# Altium project Phaser_DIOT.PrjPCB (part 8 of 10)

## Sheet LVDS_IFC.SchDoc: =P_Title
size 420 x 297 mm; EDA_Number: ARTIQ; Projet: ARTIQ/SINARA; Author: G.Kasprowicz; CompanyName: WUT ISE; DrawnBy: G.Kasprowicz; Organization: WUT ISE; Address1: PW ISE; Address2: Nowowiejska 15/19 00-665 Warsaw; Address3: gkasprow@gmail.com; DocumentNumber: 15; Revision: 2; SheetNumber: 15; SheetTotal: 19; ModifiedBy: -; CheckedDate: -; Title2: EEM connectors; DivGrp: WUT ISE; Designer: G.Kasprowicz; ModifiedDate: -; ProjectName: Sensor Box
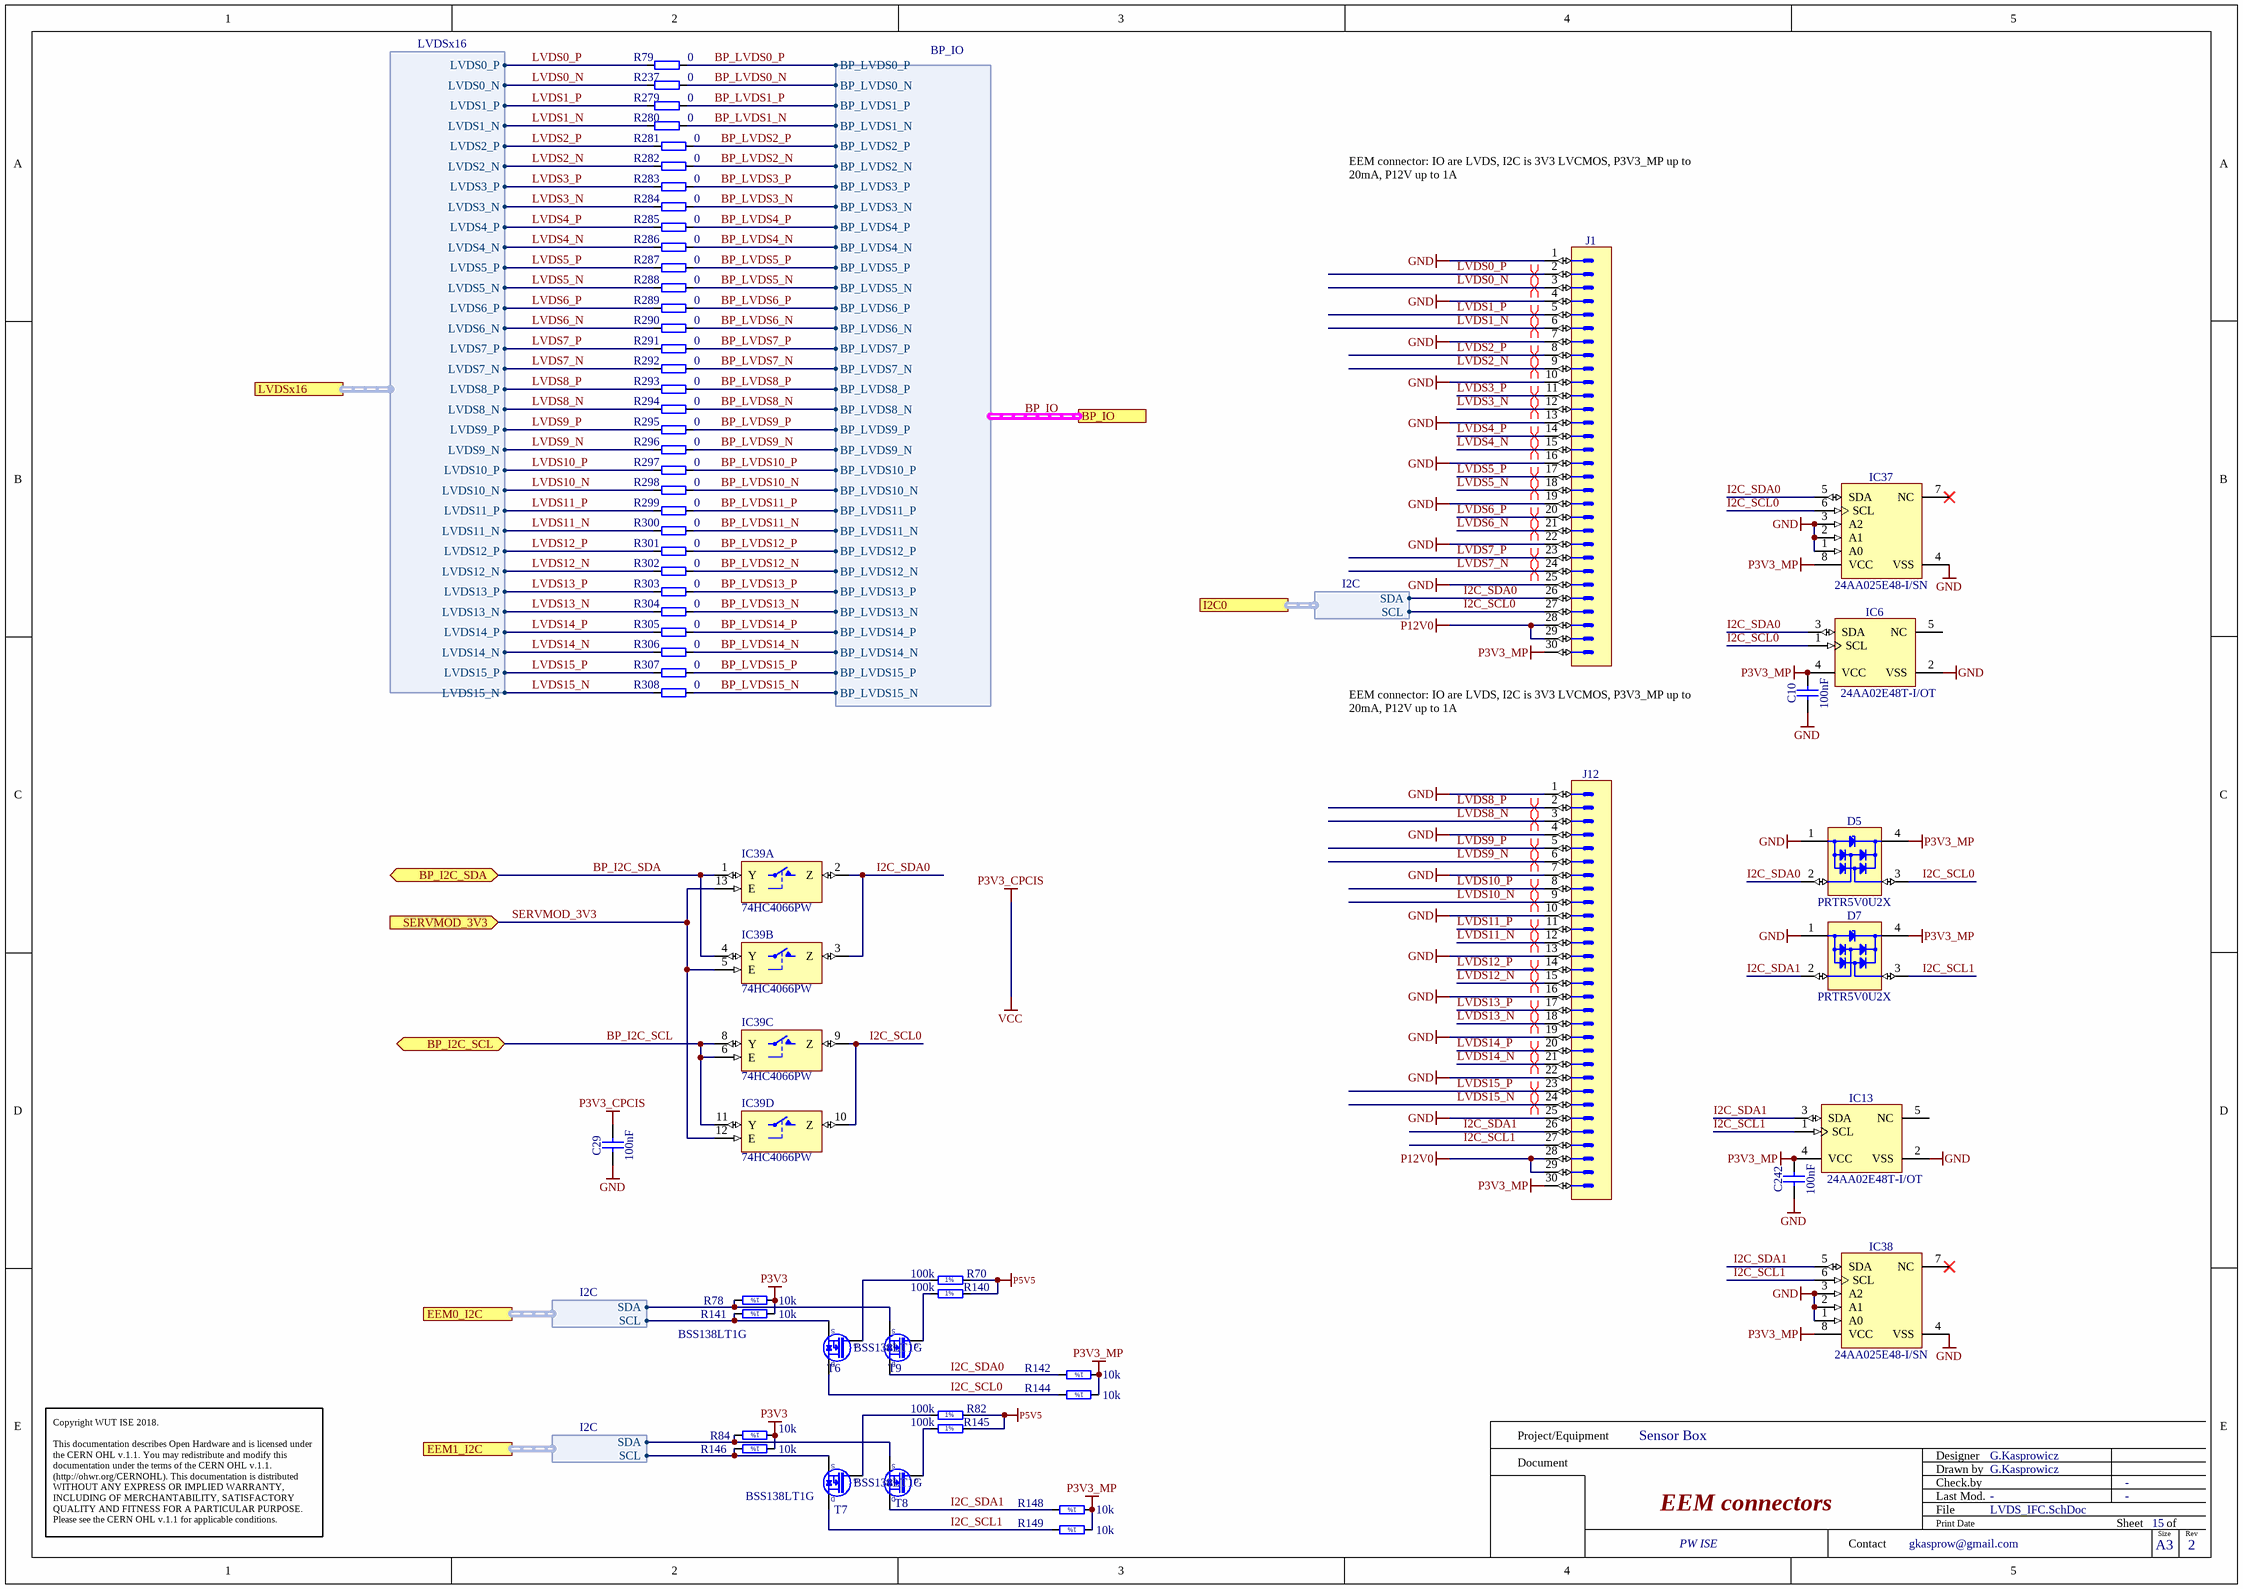
[diagram p16: LVDS_IFC.SchDoc]

### Parts
C10  100nF  [CAPC1005X55N]
C29  100nF  [CAPC1005X55N]
C242  100nF  [CAPC1005X55N]
D5  PRTR5V0U2X  [SOT190P230X110-4N]
D7  PRTR5V0U2X  [SOT190P230X110-4N]
IC6  24AA02E48T-I/OT  [SOT95P280X145-5N]
IC13  24AA02E48T-I/OT  [SOT95P280X145-5N]
IC37  24AA025E48-I/SN  [SOIC127P600X175-8N]
IC38  24AA025E48-I/SN  [SOIC127P600X175-8N]
IC39  74HC4066PW  [SOP65P640X110-14N]  (parts A,B,C,D of 4)
J1  (no value)  [3M_N2530-6002RB]
J12  (no value)  [3M_N2530-6002RB]
R70  100k  [RESC1005X40N]
R78  10k  [RESC1005X40N]
R79  0  [RESC1005X35N]
R82  100k  [RESC1005X40N]
R84  10k  [RESC1005X40N]
R140  100k  [RESC1005X40N]
R141  10k  [RESC1005X40N]
R142  10k  [RESC1005X40N]
R144  10k  [RESC1005X40N]
R145  100k  [RESC1005X40N]
R146  10k  [RESC1005X40N]
R148  10k  [RESC1005X40N]
R149  10k  [RESC1005X40N]
R237  0  [RESC1005X35N]
R279  0  [RESC1005X35N]
R280  0  [RESC1005X35N]
R281  0  [RESC1005X35N]
R282  0  [RESC1005X35N]
R283  0  [RESC1005X35N]
R284  0  [RESC1005X35N]
R285  0  [RESC1005X35N]
R286  0  [RESC1005X35N]
R287  0  [RESC1005X35N]
R288  0  [RESC1005X35N]
R289  0  [RESC1005X35N]
R290  0  [RESC1005X35N]
R291  0  [RESC1005X35N]
R292  0  [RESC1005X35N]
R293  0  [RESC1005X35N]
R294  0  [RESC1005X35N]
R295  0  [RESC1005X35N]
R296  0  [RESC1005X35N]
R297  0  [RESC1005X35N]
R298  0  [RESC1005X35N]
R299  0  [RESC1005X35N]
R300  0  [RESC1005X35N]
R301  0  [RESC1005X35N]
R302  0  [RESC1005X35N]
R303  0  [RESC1005X35N]
R304  0  [RESC1005X35N]
R305  0  [RESC1005X35N]
R306  0  [RESC1005X35N]
R307  0  [RESC1005X35N]
R308  0  [RESC1005X35N]
T6  BSS138LT1G  [SOT95P240X110-3N]
T7  BSS138LT1G  [SOT95P240X110-3N]
T8  BSS138LT1G  [SOT95P240X110-3N]
T9  BSS138LT1G  [SOT95P240X110-3N]

### Ports
BP_I2C_SCL (bidir), BP_I2C_SDA (bidir), BP_IO (harness BP_IO), EEM0_I2C (harness I2C), EEM1_I2C (harness I2C), I2C0 (harness I2C), LVDSx16 (harness LVDSx16), SERVMOD_3V3 (in)

### Harnesses
I2C: SDA, SCL
LVDSx16: LVDS0_P, LVDS0_N, LVDS1_P, LVDS1_N, LVDS2_P, LVDS2_N, LVDS3_P, LVDS3_N, LVDS4_P, LVDS4_N, LVDS5_P, LVDS5_N, LVDS6_P, LVDS6_N, LVDS7_P, LVDS7_N, LVDS8_P, LVDS8_N, LVDS9_P, LVDS9_N, LVDS10_P, LVDS10_N, LVDS11_P, LVDS11_N, LVDS12_P, LVDS12_N, LVDS13_P, LVDS13_N, LVDS14_P, LVDS14_N, LVDS15_P, LVDS15_N
BP_IO: BP_LVDS0_P, BP_LVDS0_N, BP_LVDS1_P, BP_LVDS1_N, BP_LVDS2_P, BP_LVDS2_N, BP_LVDS3_P, BP_LVDS3_N, BP_LVDS4_P, BP_LVDS4_N, BP_LVDS5_P, BP_LVDS5_N, BP_LVDS6_P, BP_LVDS6_N, BP_LVDS7_P, BP_LVDS7_N, BP_LVDS8_P, BP_LVDS8_N, BP_LVDS9_P, BP_LVDS9_N, BP_LVDS10_P, BP_LVDS10_N, BP_LVDS11_P, BP_LVDS11_N, BP_LVDS12_P, BP_LVDS12_N, BP_LVDS13_P, BP_LVDS13_N, BP_LVDS14_P, BP_LVDS14_N, BP_LVDS15_P, BP_LVDS15_N

### Nets
GND: C10.1 C29.1 C242.1 D5.1(GND) D7.1(GND) IC6.2(VSS) IC13.2(VSS) IC37.1(A0) IC37.2(A1) IC37.3(A2) IC37.4(VSS) IC38.1(A0) IC38.2(A1) IC38.3(A2) IC38.4(VSS) IC39.7(GND) J1.1 J1.4 J1.7 J1.10 J1.13 J1.16 J1.19 J1.22 J1.25 J12.1 J12.4 J12.7 J12.10 J12.13 J12.16 J12.19 J12.22 J12.25
P3V3: R78.1 R84.1 R141.1 R146.1
P3V3_CPCIS: C29.2 IC39.14(VCC)  [also labelled VCC]
P3V3_MP: C10.2 C242.2 D5.4(VCC) D7.4(VCC) IC6.4(VCC) IC13.4(VCC) IC37.8(VCC) IC38.8(VCC) J1.30 J12.30 R142.1 R144.1 R148.1 R149.1
P5V5: R70.2 R82.2 R140.2 R145.2
P12V0: J1.28 J1.29 J12.28 J12.29
BP_I2C_SCL: IC39.6(E) IC39.8(Y) IC39.11(Y) ; port BP_I2C_SCL
BP_I2C_SDA: IC39.1(Y) IC39.4(Y) ; port BP_I2C_SDA
BP_LVDS0_N: R237.1 ; port BP_IO.BP_LVDS0_N  [project net BP_IO.BP_LVDS0_N]
BP_LVDS0_P: R79.1 ; port BP_IO.BP_LVDS0_P  [project net BP_IO.BP_LVDS0_P]
BP_LVDS1_N: R280.1 ; port BP_IO.BP_LVDS1_N  [project net BP_IO.BP_LVDS1_N]
BP_LVDS1_P: R279.1 ; port BP_IO.BP_LVDS1_P  [project net BP_IO.BP_LVDS1_P]
BP_LVDS2_N: R282.1 ; port BP_IO.BP_LVDS2_N  [project net BP_IO.BP_LVDS2_N]
BP_LVDS2_P: R281.1 ; port BP_IO.BP_LVDS2_P  [project net BP_IO.BP_LVDS2_P]
BP_LVDS3_N: R284.1 ; port BP_IO.BP_LVDS3_N  [project net BP_IO.BP_LVDS3_N]
BP_LVDS3_P: R283.1 ; port BP_IO.BP_LVDS3_P  [project net BP_IO.BP_LVDS3_P]
BP_LVDS4_N: R286.1 ; port BP_IO.BP_LVDS4_N  [project net BP_IO.BP_LVDS4_N]
BP_LVDS4_P: R285.1 ; port BP_IO.BP_LVDS4_P  [project net BP_IO.BP_LVDS4_P]
BP_LVDS5_N: R288.1 ; port BP_IO.BP_LVDS5_N  [project net BP_IO.BP_LVDS5_N]
BP_LVDS5_P: R287.1 ; port BP_IO.BP_LVDS5_P  [project net BP_IO.BP_LVDS5_P]
BP_LVDS6_N: R290.1 ; port BP_IO.BP_LVDS6_N  [project net BP_IO.BP_LVDS6_N]
BP_LVDS6_P: R289.1 ; port BP_IO.BP_LVDS6_P  [project net BP_IO.BP_LVDS6_P]
BP_LVDS7_N: R292.1 ; port BP_IO.BP_LVDS7_N  [project net BP_IO.BP_LVDS7_N]
BP_LVDS7_P: R291.1 ; port BP_IO.BP_LVDS7_P  [project net BP_IO.BP_LVDS7_P]
BP_LVDS8_N: R294.1 ; port BP_IO.BP_LVDS8_N  [project net BP_IO.BP_LVDS8_N]
BP_LVDS8_P: R293.1 ; port BP_IO.BP_LVDS8_P  [project net BP_IO.BP_LVDS8_P]
BP_LVDS9_N: R296.1 ; port BP_IO.BP_LVDS9_N  [project net BP_IO.BP_LVDS9_N]
BP_LVDS9_P: R295.1 ; port BP_IO.BP_LVDS9_P  [project net BP_IO.BP_LVDS9_P]
BP_LVDS10_N: R298.1 ; port BP_IO.BP_LVDS10_N  [project net BP_IO.BP_LVDS10_N]
BP_LVDS10_P: R297.1 ; port BP_IO.BP_LVDS10_P  [project net BP_IO.BP_LVDS10_P]
BP_LVDS11_N: R300.1 ; port BP_IO.BP_LVDS11_N  [project net BP_IO.BP_LVDS11_N]
BP_LVDS11_P: R299.1 ; port BP_IO.BP_LVDS11_P  [project net BP_IO.BP_LVDS11_P]
BP_LVDS12_N: R302.1 ; port BP_IO.BP_LVDS12_N  [project net BP_IO.BP_LVDS12_N]
BP_LVDS12_P: R301.1 ; port BP_IO.BP_LVDS12_P  [project net BP_IO.BP_LVDS12_P]
BP_LVDS13_N: R304.1 ; port BP_IO.BP_LVDS13_N  [project net BP_IO.BP_LVDS13_N]
BP_LVDS13_P: R303.1 ; port BP_IO.BP_LVDS13_P  [project net BP_IO.BP_LVDS13_P]
BP_LVDS14_N: R306.1 ; port BP_IO.BP_LVDS14_N  [project net BP_IO.BP_LVDS14_N]
BP_LVDS14_P: R305.1 ; port BP_IO.BP_LVDS14_P  [project net BP_IO.BP_LVDS14_P]
BP_LVDS15_N: R308.1 ; port BP_IO.BP_LVDS15_N  [project net BP_IO.BP_LVDS15_N]
BP_LVDS15_P: R307.1 ; port BP_IO.BP_LVDS15_P  [project net BP_IO.BP_LVDS15_P]
EEM0_I2C_SCL: R141.2 T6.2(S) ; port EEM0_I2C.SCL
EEM0_I2C_SDA: R78.2 T9.2(S) ; port EEM0_I2C.SDA
EEM1_I2C_SCL: R146.2 T7.2(S) ; port EEM1_I2C.SCL
EEM1_I2C_SDA: R84.2 T8.2(S) ; port EEM1_I2C.SDA
I2C_SCL0: D5.3(I/O2) IC6.1(SCL) IC37.6(SCL) IC39.9(Z) IC39.10(Z) J1.27 R144.2 T6.3(D) ; port I2C0.SCL
I2C_SCL1: D7.3(I/O2) IC13.1(SCL) IC38.6(SCL) J12.27 R149.2 T7.3(D)
I2C_SDA0: D5.2(I/O1) IC6.3(SDA) IC37.5(SDA) IC39.2(Z) IC39.3(Z) J1.26 R142.2 T9.3(D) ; port I2C0.SDA
I2C_SDA1: D7.2(I/O1) IC13.3(SDA) IC38.5(SDA) J12.26 R148.2 T8.3(D)
LVDS0_N: J1.3 R237.2 ; port LVDSx16.LVDS0_N
LVDS0_P: J1.2 R79.2 ; port LVDSx16.LVDS0_P
LVDS1_N: J1.6 R280.2 ; port LVDSx16.LVDS1_N
LVDS1_P: J1.5 R279.2 ; port LVDSx16.LVDS1_P
LVDS2_N: J1.9 R282.2 ; port LVDSx16.LVDS2_N
LVDS2_P: J1.8 R281.2 ; port LVDSx16.LVDS2_P
LVDS3_N: J1.12 R284.2 ; port LVDSx16.LVDS3_N
LVDS3_P: J1.11 R283.2 ; port LVDSx16.LVDS3_P
LVDS4_N: J1.15 R286.2 ; port LVDSx16.LVDS4_N
LVDS4_P: J1.14 R285.2 ; port LVDSx16.LVDS4_P
LVDS5_N: J1.18 R288.2 ; port LVDSx16.LVDS5_N
LVDS5_P: J1.17 R287.2 ; port LVDSx16.LVDS5_P
LVDS6_N: J1.21 R290.2 ; port LVDSx16.LVDS6_N
LVDS6_P: J1.20 R289.2 ; port LVDSx16.LVDS6_P
LVDS7_N: J1.24 R292.2 ; port LVDSx16.LVDS7_N
LVDS7_P: J1.23 R291.2 ; port LVDSx16.LVDS7_P
LVDS8_N: J12.3 R294.2 ; port LVDSx16.LVDS8_N
LVDS8_P: J12.2 R293.2 ; port LVDSx16.LVDS8_P
LVDS9_N: J12.6 R296.2 ; port LVDSx16.LVDS9_N
LVDS9_P: J12.5 R295.2 ; port LVDSx16.LVDS9_P
LVDS10_N: J12.9 R298.2 ; port LVDSx16.LVDS10_N
LVDS10_P: J12.8 R297.2 ; port LVDSx16.LVDS10_P
LVDS11_N: J12.12 R300.2 ; port LVDSx16.LVDS11_N
LVDS11_P: J12.11 R299.2 ; port LVDSx16.LVDS11_P
LVDS12_N: J12.15 R302.2 ; port LVDSx16.LVDS12_N
LVDS12_P: J12.14 R301.2 ; port LVDSx16.LVDS12_P
LVDS13_N: J12.18 R304.2 ; port LVDSx16.LVDS13_N
LVDS13_P: J12.17 R303.2 ; port LVDSx16.LVDS13_P
LVDS14_N: J12.21 R306.2 ; port LVDSx16.LVDS14_N
LVDS14_P: J12.20 R305.2 ; port LVDSx16.LVDS14_P
LVDS15_N: J12.24 R308.2 ; port LVDSx16.LVDS15_N
LVDS15_P: J12.23 R307.2 ; port LVDSx16.LVDS15_P
SERVMOD_3V3: IC39.5(E) IC39.12(E) IC39.13(E) ; port SERVMOD_3V3
NetR70_1: R70.1 T6.1(G)
NetR82_1: R82.1 T7.1(G)
NetR140_1: R140.1 T9.1(G)
NetR145_1: R145.1 T8.1(G)

Not connected (* = marked no-connect by the designer): IC6 5(NC); IC13 5(NC); IC37 7(NC)*; IC38 7(NC)*

### Buses and harness runs
harness BP_IO = port BP_IO

### Layout directives
differential pair; differential pair class EEM0; net class EEM0: LVDS0_N, LVDS0_P, LVDS1_N, LVDS1_P, LVDS2_N, LVDS2_P, LVDS3_N, LVDS3_P, LVDS4_N, LVDS4_P, LVDS5_N, LVDS5_P, LVDS6_N, LVDS6_P, LVDS7_N, LVDS7_P
differential pair; differential pair class EEM1; net class EEM1: LVDS8_N, LVDS8_P, LVDS9_N, LVDS9_P, LVDS10_N, LVDS10_P, LVDS11_N, LVDS11_P, LVDS12_N, LVDS12_P, LVDS13_N, LVDS13_P, LVDS14_N, LVDS14_P, LVDS15_N, LVDS15_P
differential pair; differential pair class EEM1: LVDS11_P

### Notes on the sheet
- (near J1) EEM connector: IO are LVDS, I2C is 3V3 LVCMOS, P3V3_MP up to 20mA, P12V up to 1A
- EEM connector: IO are LVDS, I2C is 3V3 LVCMOS, P3V3_MP up to 20mA, P12V up to 1A
- Project/Equipment
- Document
- Designer
- Drawn by
- Check.by
- Copyright WUT ISE 2018.
  This documentation describes Open Hardware and is licensed under the CERN OHL v.1.1. You may redistribute and modify this documentation under the terms of the CERN OHL v.1.1. (http://ohwr.org/CERNOHL). This documentation is distributed WITHOUT ANY EXPRESS OR IMPLIED WARRANTY, INCLUDING OF MERCHANTABILITY, SATISFACTORY QUALITY AND FITNESS FOR A PARTICULAR PURPOSE. Please see the CERN OHL v.1.1 for applicable conditions.
- Contact
- File
- Last Mod.
- Print Date
- Sheet
- Size
- A3
- of
- Rev
- (in symbol R0402_10k_1%_0.0625W_100PPM) 1%
- (in symbol R0402_100K_1%_0.0625W_100PPM) 1%

### Library data of the parts
C10 C29 C242 = CC0402_100NF_16V_10%_X5R: Non-polarised capacitor; Part Description: SMD Multilayer Chip Ceramic Capacitor; Manufacturer: GENERIC; Manufacturer1 Part Number: GRM155R61C104KA88D; Voltage: 16V; TC: X5R; Tolerance: ±10%; Part Number: CC0402_100NF_16V_10%_X5R; Component Kind: Standard; Component Type: Standard; Pin Count: 2; Value: 100nF; Status: None; Manufacturer Part Number: CC0402_100NF_16V_10%_X5R; Case: 0402; Mounted: Yes; Socket: No; SMD: Yes; Sense: No; Manufacturer1 Example: MURATA; Manufacturer1 ComponentHeight: 0.55mm; HelpURL: \\cern.ch\dfs\Applications\Altium\Datasheets\CC0402_X5R_MURATA_GRM.pdf; Author: CERN DEM JLC; CreateDate: 10.12.2013; LatestRevisionDate: 10.12.2013
D5 D7 = PRTR5V0U2X: Ultra Low Capacitance Double Rail-to-Rail ESD Protection Diode; Part Description: Ultra Low Capacitance (1pF) Double Rail-to-Rail ESD Protection Diode (8kV); Manufacturer: NXP SEMICONDUCTORS; Voltage: 5.5V; PressFit: No; Bonding: No; Part Number: PRTR5V0U2X; Component Kind: Standard; Component Type: Standard; Device: PRTR5V0U2X; PackageDescription: SOT143B, SOT, 1.90mm Pitch; 4 Pin, 1.30mm W X 2.90mm L X 1.10mm H body, IPC Medium Density; Manufacturer Part Number: PRTR5V0U2X; Pin Count: 4; Case: SOT143B; Mounted: Yes; Socket: No; SMD: Yes; Sense: No; ComponentHeight: 1.1mm; HelpURL: \\cern.ch\dfs\Applications\Altium\Datasheets\PRTR5V0U2X.pdf; Author: CERN DEM JLC; CreateDate: 22.03.2011; LatestRevisionDate: 22.03.2011
IC6 IC13 = 24AA02E48T-I/OT: 1.7V-5.5V, 2K I2C Serial EEPROM With EUI-48 Node Identity; Manufacturer: MICROCHIP TECHNOLOGY; PressFit: No; Bonding: No; Part Number: 24AA02E48T-I/OT; Component Kind: Standard; Component Type: Standard; Device: 24AA02E48T-I/OT; PackageDescription: SOT, 0.95mm pitch; 5 pin, 1.60mm W X 2.90mm L X 1.45mm H body, IPC Medium Density; Part Description: 1.7V-5.5V, 2K I2C Serial EEPROM With EUI-48 Node Identity; Manufacturer Part Number: 24AA02E48T-I/OT; Pin Count: 5; Case: SOT23-5; Mounted: Yes; Socket: No; SMD: Yes; Sense: No; ComponentHeight: 1.45mm; HelpURL: \\cern.ch\dfs\Applications\Altium\Datasheets\24AA02E48T-I-OT.pdf; Author: CERN DEM MR; CreateDate: 31.03.2016; LatestRevisionDate: 31.03.2016
IC37 IC38 = 24AA025E48-I/SN: 1.7V-5.5V, 2K I2C™ Serial EEPROMs with EUI-48™ Node Identity; Manufacturer: MICROCHIP TECHNOLOGY; PressFit: No; Bonding: No; Part Number: 24AA025E48-I/SN; Component Kind: Standard; Component Type: Standard; Device: 24AA025E48-I/SN; PackageDescription: SOIC 8, Pitch 1.27mm - Body 4x5mm, IPC Medium Density; Part Description: 1.7V-5.5V, 2K I2C™ Serial EEPROMs with EUI-48™ Node Identity; Manufacturer Part Number: 24AA025E48-I/SN; Pin Count: 8; Case: SOIC8; Mounted: Yes; Socket: No; SMD: Yes; Sense: No; ComponentHeight: 1.75mm; HelpURL: \\cern.ch\dfs\Applications\Altium\Datasheets\24AA025E48-I-SN.pdf; Author: CERN DEM MR; CreateDate: 19.07.2016; LatestRevisionDate: 19.07.2016
IC39 = 74HC4066PW: Part Description: Quad Single-Pole Single-Throw Analog Switch; Manufacturer: NXP SEMICONDUCTORS; PressFit: No; Bonding: No; Part Number: 74HC4066PW; Component Kind: Standard; Component Type: Standard; Device: 74HC4066PW; PackageDescription: SOP, 0.65mm Pitch; 14 Pin, 4.40mm W X 5.00mm L X 1.20mm H body, IPC Medium Density; Manufacturer Part Number: 74HC4066PW; Pin Count: 14; Case: TSSOP14; Mounted: Yes; Socket: No; SMD: Yes; Sense: No; ComponentHeight: 1.1mm; Author: CERN DEM JLC; HelpURL: \\cern.ch\dfs\Applications\Altium\Datasheets\74HC4066PW.pdf; CreateDate: 19.11.2014; LatestRevisionDate: 19.11.2014
J1 J12 = 3M_N2530-6002RB: Connector 30 Male; Part Description: 30 Contacts - Straight .100'' x .100'' Low Profile Four-Wall Header, 2500 Series; Manufacturer: 3M; PressFit: No; Part Number: 3M_N2530-6002RB; Component Kind: Standard; Component Type: Standard; Pin Count: 30; Family: Header 30; Mounted: Yes; Socket: No; SMD: No; Sense: No; Status: None; Manufacturer Part Number: N2530-6002RB; ComponentHeight: 10.03mm; HelpURL: \\cern.ch\dfs\Applications\Altium\Datasheets\3M_N2530-6002RB.pdf; Author: CERN DEM JLC; CreateDate: 11.02.2009; LatestRevisionDate: 11.08.2009
R70 R82 R140 R145 = R0402_100K_1%_0.0625W_100PPM: Resistor - 1%; Part Description: General Purpose Thick Film Chip Resistor; Manufacturer: GENERIC; Manufacturer1 Part Number: 232270671004L; TC: ±100ppm/°C; PressFit: No; Part Number: R0402_100K_1%_0.0625W_100PPM; Component Kind: Standard; Component Type: Standard; Pin Count: 2; Value: 100k; Status: Not Recommended; Power: 0.0625W; Tolerance: ±1%; Manufacturer Part Number: R0402_100K_1%_0.0625W_100PPM; Case: 0402; Mounted: Yes; Sense: No; Socket: No; SMD: Yes; Manufacturer1 Example: YAGEO PHYCOMP; Manufacturer1 ComponentHeight: 0.4mm; HelpURL: \\cern.ch\dfs\Applications\Altium\Datasheets\R0402_Phycomp_RC0402.pdf; Author: CERN DEM JLC; CreateDate: 03/12/2007; LatestRevisionDate: 17/10/2012
R78 R84 R141 R142 R144 R146 R148 R149 = R0402_10k_1%_0.0625W_100PPM: Resistor - 1%; Part Description: General Purpose Thick Film Chip Resistor; Manufacturer: GENERIC; Manufacturer1 Part Number: 232270671003L; TC: ±100ppm/°C; PressFit: No; Part Number: R0402_10K_1%_0.0625W_100PPM; Component Kind: Standard; Component Type: Standard; Pin Count: 2; Value: 10k; Status: Not Recommended; Power: 0.0625W; Tolerance: ±1%; Manufacturer Part Number: R0402_10K_1%_0.0625W_100PPM; Case: 0402; Mounted: Yes; Sense: No; Socket: No; SMD: Yes; Manufacturer1 Example: YAGEO PHYCOMP; Manufacturer1 ComponentHeight: 0.4mm; HelpURL: \\cern.ch\dfs\Applications\Altium\Datasheets\R0402_Phycomp_RC0402.pdf; Author: CERN DEM JLC; CreateDate: 03.12.2007; LatestRevisionDate: 17.10.2012
R79 R237 R279-R308 = R0402_0R_JUMPER: Resistor; Part Description: 1A (0.05R Max DC Resistance) Zero Ohm Jumper; Manufacturer: GENERIC; Manufacturer1 Part Number: 232270591001L; Part Number: R0402_0R_JUMPER; Component Kind: Standard; Component Type: Standard; Footprint: RESC1005X40N; Pin Count: 2; Value: 0; Status: Not recommended; Manufacturer Part Number: R0402_0R_JUMPER; Case: 0402; Mounted: Yes; Sense: No; Socket: No; SMD: Yes; Manufacturer1 Example: YAGEO PHYCOMP; Manufacturer1 ComponentHeight: 0.4mm; HelpURL: \\cern.ch\dfs\Applications\Altium\Datasheets\R0402_Phycomp_RC0402.pdf; Author: CERN DEM JLC; CreateDate: 03.12.2007; LatestRevisionDate: 17.10.2012
T6-T9 = BSS138LT1G: N-CHANNEL MOSFET WITH DIODE; Part Description: 50V 200mA N-Channel Enhancement Mode Field-Effect Transistor; Manufacturer: ON SEMICONDUCTOR; PressFit: No; Bonding: No; Part Number: BSS138LT1G; Component Kind: Standard; Component Type: Standard; Device: BSS138LT1G; PackageDescription: SOT23 3-Leads, Pitch 0.95mm - Body 1.4x3mm, IPC Medium Density; Manufacturer Part Number: BSS138LT1G; Pin Count: 3; Case: SOT23-3; Mounted: Yes; Socket: No; SMD: Yes; Sense: No; ComponentHeight: 1.11mm; HelpURL: \\cern.ch\dfs\Applications\Altium\Datasheets\BSS138LT1G.pdf; Author: CERN DEM JLC; CreateDate: 23.03.2009; LatestRevisionDate: 23.03.2009

## Sheet CPCIS_Connectors_P1_P6.SchDoc: =P_Title
size 420 x 297 mm; Author: M.Mroz; CompanyName: WUT ISE; DrawnBy: M.Mroz; Organization: WUT ISE; Address1: PW ISE; Address2: Nowowiejska 15/19 00-665 Warsaw; Address3: gkasprow@gmail.com; Revision: 2; SheetNumber: 19; SheetTotal: 19; ModifiedBy: M.Mroz; Title2: CPCIS Connectors
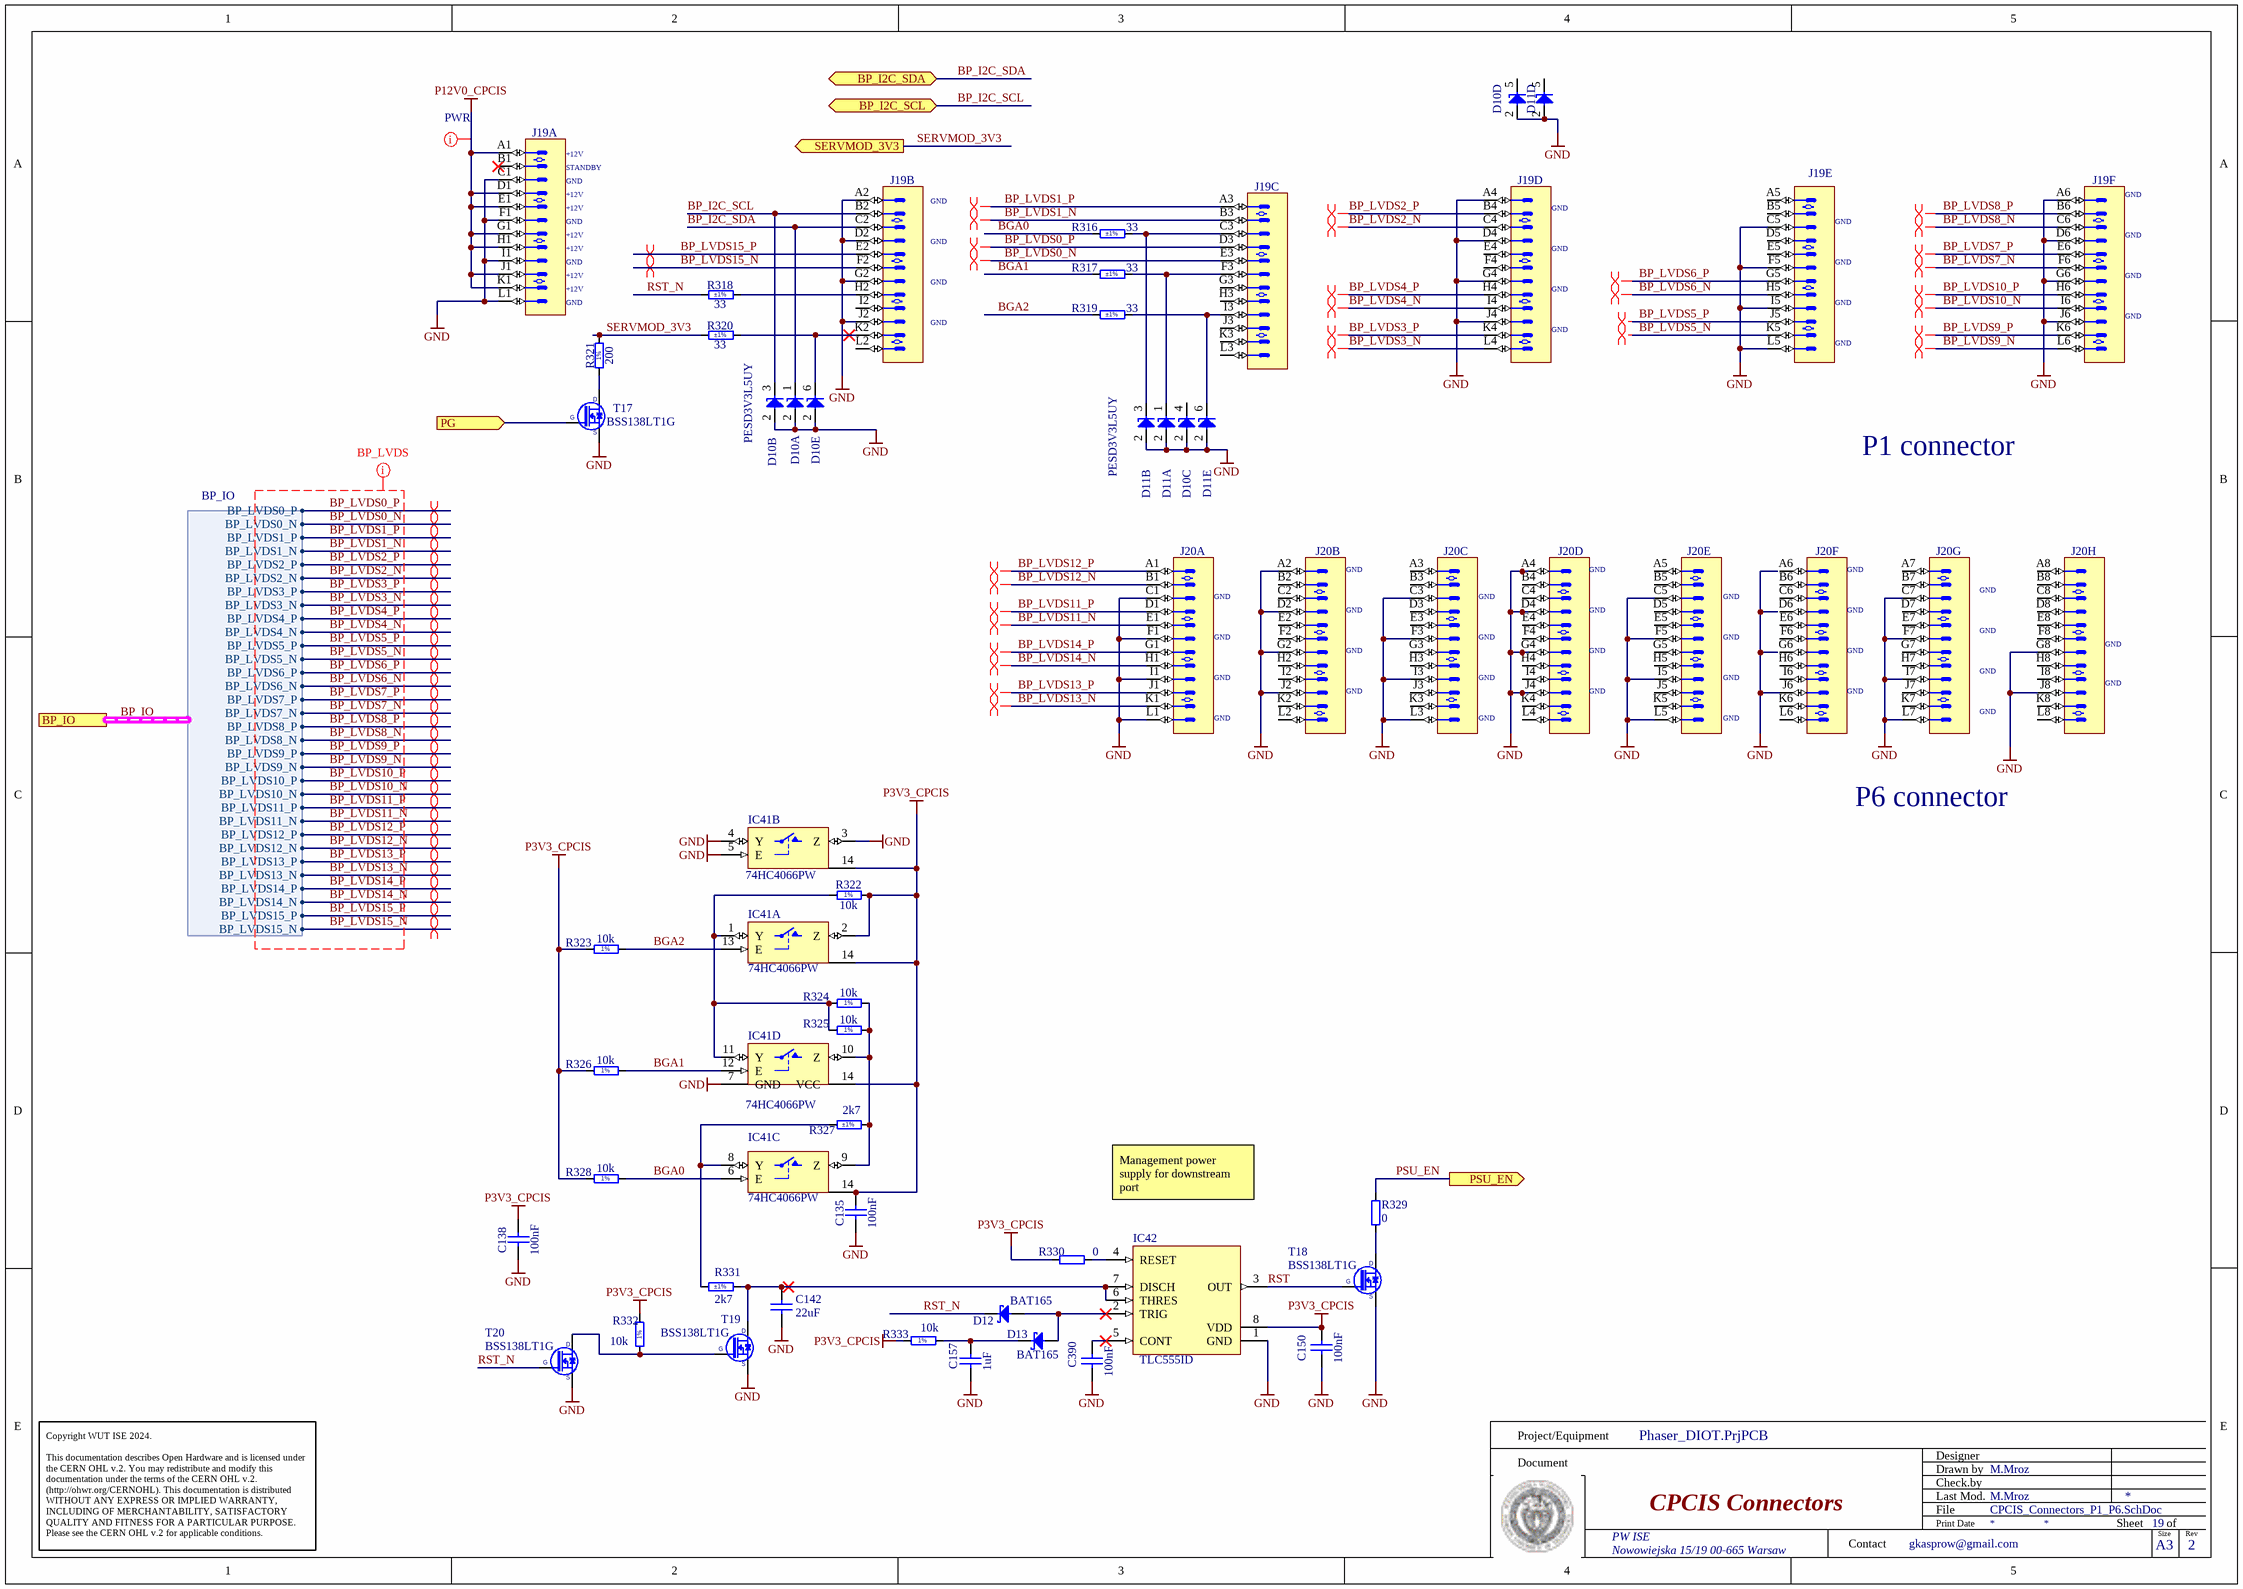
[diagram p17: CPCIS_Connectors_P1_P6.SchDoc]

### Parts
C135  100nF  [CAPC1005X55N]
C138  100nF  [CAPC1005X55N]
C142  22uF  [CAPC2012X135N]
C150  100nF  [CAPC1005X55N]
C157  1uF  [CAPC1608X87N]
C390  100nF  [CAPC1005X55N]
D10  PESD3V3L5UY  [SOT65P210X110-6N]  (value not drawn)  (parts A,B,C,D,E of 5)
D11  PESD3V3L5UY  [SOT65P210X110-6N]  (value not drawn)  (parts A,B,D,E of 5)
D12  BAT165  [SOD2512X110N]
D13  BAT165  [SOD2512X110N]
IC41  74HC4066PW  [SOP65P640X110-14N]  (parts A,B,C,D of 4)
IC42  TLC555ID  [SOIC127P600X175-8N]
J19  (no value)  [AMPHENOL_10052825-101LF]  (parts A,B,C,D,E,F of 6)
J20  (no value)  [AMPHENOL_10052838-101LF]  (parts A,B,C,D,E,F,G,H of 8)
R316  33  Tolerance: ±1%  [RESC1005X40N]
R317  33  Tolerance: ±1%  [RESC1005X40N]
R318  33  Tolerance: ±1%  [RESC1005X40N]
R319  33  Tolerance: ±1%  [RESC1005X40N]
R320  33  Tolerance: ±1%  [RESC1005X40N]
R321  200  [RESC1005X40N]
R322  10k  [RESC1005X40N]
R323  10k  [RESC1005X40N]
R324  10k  [RESC1005X40N]
R325  10k  [RESC1005X40N]
R326  10k  [RESC1005X40N]
R327  2k7  Tolerance: ±1%  [RESC1608X55N]
R328  10k  [RESC1005X40N]
R329  0  [RESC1005X35N]
R330  0  [RESC1005X35N]
R331  2k7  Tolerance: ±1%  [RESC1608X55N]
R332  10k  [RESC1005X40N]
R333  10k  [RESC1005X40N]
T17  BSS138LT1G  [SOT95P240X110-3N]
T18  BSS138LT1G  [SOT95P240X110-3N]
T19  BSS138LT1G  [SOT95P240X110-3N]
T20  BSS138LT1G  [SOT95P240X110-3N]

### Ports
BP_I2C_SCL (bidir), BP_I2C_SDA (bidir), BP_IO (harness BP_IO), PG (in), PSU_EN (out), SERVMOD_3V3 (out)

### Harnesses
BP_IO: BP_LVDS0_P, BP_LVDS0_N, BP_LVDS1_P, BP_LVDS1_N, BP_LVDS2_P, BP_LVDS2_N, BP_LVDS3_P, BP_LVDS3_N, BP_LVDS4_P, BP_LVDS4_N, BP_LVDS5_P, BP_LVDS5_N, BP_LVDS6_P, BP_LVDS6_N, BP_LVDS7_P, BP_LVDS7_N, BP_LVDS8_P, BP_LVDS8_N, BP_LVDS9_P, BP_LVDS9_N, BP_LVDS10_P, BP_LVDS10_N, BP_LVDS11_P, BP_LVDS11_N, BP_LVDS12_P, BP_LVDS12_N, BP_LVDS13_P, BP_LVDS13_N, BP_LVDS14_P, BP_LVDS14_N, BP_LVDS15_P, BP_LVDS15_N

### Nets
GND: C135.1 C138.1 C142.1 C150.1 C157.1 C390.1 D10.2(A) D11.2(A) IC41.3(Z) IC41.4(Y) IC41.5(E) IC41.7(GND) IC42.1(GND) J19.A2 J19.A4 J19.A6 J19.C1 J19.C5 J19.D2 J19.D4 J19.D6 J19.F1 J19.F5 J19.G2 J19.G4 J19.G6 J19.I1 J19.I5 J19.J2 J19.J4 J19.J6 J19.L1 J19.L5 J20.A2 J20.A4 J20.C1 J20.C3 J20.C5 J20.C7 J20.D2 J20.D4 J20.F1 J20.F3 J20.F5 J20.F7 J20.G2 J20.G4 J20.G8 J20.I1 J20.I3 J20.I5 J20.I7 J20.J2 J20.J4 J20.J6 J20.J8 J20.L1 J20.L3 J20.L5 J20.L7 T17.2(S) T18.2(S) T19.2(S) T20.2(S)
P3V3_CPCIS: C135.2 C138.2 C150.2 IC41.2(Z) IC41.14(VCC) IC42.8(VDD) R322.2 R323.1 R326.1 R328.1 R330.2 R332.2 R333.1
P12V0_CPCIS: J19.A1 J19.D1 J19.E1 J19.G1 J19.H1 J19.J1 J19.K1
BGA0: IC41.6(E) R316.1 R328.2
BGA1: IC41.12(E) R317.1 R326.2
BGA2: IC41.13(E) R319.1 R323.2
BP_I2C_SCL: D10.3(C) J19.B2 ; port BP_I2C_SCL
BP_I2C_SDA: D10.1(C) J19.C2 ; port BP_I2C_SDA
BP_LVDS0_N: J19.E3 ; port BP_IO.BP_LVDS0_N  [project net BP_IO.BP_LVDS0_N]
BP_LVDS0_P: J19.D3 ; port BP_IO.BP_LVDS0_P  [project net BP_IO.BP_LVDS0_P]
BP_LVDS1_N: J19.B3 ; port BP_IO.BP_LVDS1_N  [project net BP_IO.BP_LVDS1_N]
BP_LVDS1_P: J19.A3 ; port BP_IO.BP_LVDS1_P  [project net BP_IO.BP_LVDS1_P]
BP_LVDS2_N: J19.C4 ; port BP_IO.BP_LVDS2_N  [project net BP_IO.BP_LVDS2_N]
BP_LVDS2_P: J19.B4 ; port BP_IO.BP_LVDS2_P  [project net BP_IO.BP_LVDS2_P]
BP_LVDS3_N: J19.L4 ; port BP_IO.BP_LVDS3_N  [project net BP_IO.BP_LVDS3_N]
BP_LVDS3_P: J19.K4 ; port BP_IO.BP_LVDS3_P  [project net BP_IO.BP_LVDS3_P]
BP_LVDS4_N: J19.I4 ; port BP_IO.BP_LVDS4_N  [project net BP_IO.BP_LVDS4_N]
BP_LVDS4_P: J19.H4 ; port BP_IO.BP_LVDS4_P  [project net BP_IO.BP_LVDS4_P]
BP_LVDS5_N: J19.K5 ; port BP_IO.BP_LVDS5_N  [project net BP_IO.BP_LVDS5_N]
BP_LVDS5_P: J19.J5 ; port BP_IO.BP_LVDS5_P  [project net BP_IO.BP_LVDS5_P]
BP_LVDS6_N: J19.H5 ; port BP_IO.BP_LVDS6_N  [project net BP_IO.BP_LVDS6_N]
BP_LVDS6_P: J19.G5 ; port BP_IO.BP_LVDS6_P  [project net BP_IO.BP_LVDS6_P]
BP_LVDS7_N: J19.F6 ; port BP_IO.BP_LVDS7_N  [project net BP_IO.BP_LVDS7_N]
BP_LVDS7_P: J19.E6 ; port BP_IO.BP_LVDS7_P  [project net BP_IO.BP_LVDS7_P]
BP_LVDS8_N: J19.C6 ; port BP_IO.BP_LVDS8_N  [project net BP_IO.BP_LVDS8_N]
BP_LVDS8_P: J19.B6 ; port BP_IO.BP_LVDS8_P  [project net BP_IO.BP_LVDS8_P]
BP_LVDS9_N: J19.L6 ; port BP_IO.BP_LVDS9_N  [project net BP_IO.BP_LVDS9_N]
BP_LVDS9_P: J19.K6 ; port BP_IO.BP_LVDS9_P  [project net BP_IO.BP_LVDS9_P]
BP_LVDS10_N: J19.I6 ; port BP_IO.BP_LVDS10_N  [project net BP_IO.BP_LVDS10_N]
BP_LVDS10_P: J19.H6 ; port BP_IO.BP_LVDS10_P  [project net BP_IO.BP_LVDS10_P]
BP_LVDS11_N: J20.E1 ; port BP_IO.BP_LVDS11_N  [project net BP_IO.BP_LVDS11_N]
BP_LVDS11_P: J20.D1 ; port BP_IO.BP_LVDS11_P  [project net BP_IO.BP_LVDS11_P]
BP_LVDS12_N: J20.B1 ; port BP_IO.BP_LVDS12_N  [project net BP_IO.BP_LVDS12_N]
BP_LVDS12_P: J20.A1 ; port BP_IO.BP_LVDS12_P  [project net BP_IO.BP_LVDS12_P]
BP_LVDS13_N: J20.K1 ; port BP_IO.BP_LVDS13_N  [project net BP_IO.BP_LVDS13_N]
BP_LVDS13_P: J20.J1 ; port BP_IO.BP_LVDS13_P  [project net BP_IO.BP_LVDS13_P]
BP_LVDS14_N: J20.H1 ; port BP_IO.BP_LVDS14_N  [project net BP_IO.BP_LVDS14_N]
BP_LVDS14_P: J20.G1 ; port BP_IO.BP_LVDS14_P  [project net BP_IO.BP_LVDS14_P]
BP_LVDS15_N: J19.F2 ; port BP_IO.BP_LVDS15_N  [project net BP_IO.BP_LVDS15_N]
BP_LVDS15_P: J19.E2 ; port BP_IO.BP_LVDS15_P  [project net BP_IO.BP_LVDS15_P]
PG: T17.1(G) ; port PG
PSU_EN: R329.1 ; port PSU_EN
RST: IC42.3(OUT) T18.1(G)
RST_N: D12.1(C) R318.1 T20.1(G)
SERVMOD_3V3: R320.1 R321.2 ; port SERVMOD_3V3
NetC142_2: C142.2 IC42.6(THRES) IC42.7(DISCH) R331.2 T19.3(D)
NetC157_2: C157.2 D13.1(C) R333.2
NetC390_2: C390.2 IC42.5(CONT)
NetD10_6: D10.6(C) J19.K2 R320.2
NetD11_1: D11.1(C) J19.F3 R317.2
NetD11_3: D11.3(C) J19.C3 R316.2
NetD11_6: D11.6(C) J19.I3 R319.2
NetD12_2: D12.2(A) D13.2(A) IC42.2(TRIG)
NetIC41_1: IC41.1(Y) IC41.11(Y) R322.1 R324.1 R325.1
NetIC41_8: IC41.8(Y) R327.1 R331.1
NetIC41_9: IC41.9(Z) IC41.10(Z) R324.2 R325.2 R327.2
NetIC42_4: IC42.4(RESET) R330.1
NetJ19_H2: J19.H2 R318.2
NetR321_1: R321.1 T17.3(D)
NetR329_2: R329.2 T18.3(D)
NetR332_1: R332.1 T19.1(G) T20.3(D)

Not connected (* = marked no-connect by the designer): D10 4(C) 5(C); D11 5(C); J19 A5 B1* B5 D5 E4 E5 F4 G3 H3 I2 J3 K3 L2 L3; J20 A3 A5 A6 A7 A8 B2 B3 B4 B5 B6 B7 B8 C2 C4 C6 C8 D3 D5 D6 D7 D8 E2 E3 E4 E5 E6 E7 E8 F2 F4 F6 F8 G3 G5 G6 G7 H2 H3 H4 H5 H6 H7 H8 I2 I4 I6 I8 J3 J5 J7 K2 K3 K4 K5 K6 K7 K8 L2 L4 L6 L8

### Buses and harness runs
harness BP_IO = port BP_IO

### Layout directives
differential pair: BP_IO.BP_LVDS0_N, BP_IO.BP_LVDS0_P, BP_IO.BP_LVDS1_N, BP_IO.BP_LVDS1_P, BP_IO.BP_LVDS2_N, BP_IO.BP_LVDS2_P, BP_IO.BP_LVDS3_N, BP_IO.BP_LVDS3_P, BP_IO.BP_LVDS4_N, BP_IO.BP_LVDS4_P, BP_IO.BP_LVDS5_N, BP_IO.BP_LVDS5_P, BP_IO.BP_LVDS6_N, BP_IO.BP_LVDS6_P, BP_IO.BP_LVDS7_N, BP_IO.BP_LVDS7_P, BP_IO.BP_LVDS8_N, BP_IO.BP_LVDS8_P, BP_IO.BP_LVDS9_N, BP_IO.BP_LVDS9_P, BP_IO.BP_LVDS10_N, BP_IO.BP_LVDS10_P, BP_IO.BP_LVDS11_N, BP_IO.BP_LVDS11_P, BP_IO.BP_LVDS12_N, BP_IO.BP_LVDS12_P, BP_IO.BP_LVDS13_N, BP_IO.BP_LVDS13_P, BP_IO.BP_LVDS14_N, BP_IO.BP_LVDS14_P, BP_IO.BP_LVDS15_N, BP_IO.BP_LVDS15_P
net class PWR: P12V0_CPCIS
net class BP_LVDS: BP_LVDS0_N, BP_LVDS0_P, BP_LVDS1_N, BP_LVDS1_P, BP_LVDS2_N, BP_LVDS2_P, BP_LVDS3_N, BP_LVDS3_P, BP_LVDS4_N, BP_LVDS4_P, BP_LVDS5_N, BP_LVDS5_P, BP_LVDS6_N, BP_LVDS6_P, BP_LVDS7_N, BP_LVDS7_P, BP_LVDS8_N, BP_LVDS8_P, BP_LVDS9_N, BP_LVDS9_P, BP_LVDS10_N, BP_LVDS10_P, BP_LVDS11_N, BP_LVDS11_P, BP_LVDS12_N, BP_LVDS12_P, BP_LVDS13_N, BP_LVDS13_P, BP_LVDS14_N, BP_LVDS14_P, BP_LVDS15_N, BP_LVDS15_P

### Notes on the sheet
- (near J19) +12V
- (near J19) STANDBY
- (near J19) GND
- +12V
- GND
- P1 connector
- (near J20) GND
- P6 connector
- Management power supply for downstream port
- Project/Equipment
- Document
- Designer
- Drawn by
- Check.by
- Copyright WUT ISE 2024.
  This documentation describes Open Hardware and is licensed under the CERN OHL v.2. You may redistribute and modify this documentation under the terms of the CERN OHL v.2. (http://ohwr.org/CERNOHL). This documentation is distributed WITHOUT ANY EXPRESS OR IMPLIED WARRANTY, INCLUDING OF MERCHANTABILITY, SATISFACTORY QUALITY AND FITNESS FOR A PARTICULAR PURPOSE. Please see the CERN OHL v.2 for applicable conditions.
- Contact
- File
- Last Mod.
- Print Date
- Sheet
- Size
- A3
- of
- Rev
- (in symbol R0402_10K_1%_0.0625W_100PPM) 1%
- (in symbol R0402_200R_1%_0.0625W_100PPM) 1%

### Library data of the parts
C135 C138 C150 C390 = CC0402_100NF_16V_10%_X5R: as C10 on sheet LVDS_IFC; Part Number: CC0402_100NF_16V_10%_X5R; Component Kind: Standard; Component Type: Standard; Pin Count: 2; Value: 100nF; Status: None; Manufacturer Part Number: CC0402_100NF_16V_10%_X5R; Case: 0402; Mounted: Yes; Socket: No; SMD: Yes; Sense: No; Manufacturer1 Example: MURATA; Manufacturer1 ComponentHeight: 0.55mm; HelpURL: \\cern.ch\dfs\Applications\Altium\Datasheets\CC0402_X5R_MURATA_GRM.pdf; Author: CERN DEM JLC; CreateDate: 10.12.2013; LatestRevisionDate: 10.12.2013
C142 = CC0805_22UF_16V_10%_X5R: Non-polarised capacitor; Part Description: SMD Multilayer Chip Ceramic Capacitor; Manufacturer: GENERIC; Manufacturer1 Part Number: C2012X5R1C226KT; Voltage: 16V; TC: X5R; Tolerance: ±10%; Part Number: CC0805_22UF_16V_10%_X5R; Component Kind: Standard; Component Type: Standard; Pin Count: 2; Value: 22uF; Status: Preferred; Manufacturer Part Number: CC0805_22UF_16V_10%_X5R; Case: 0805; Mounted: Yes; Socket: No; SMD: Yes; Sense: No; Manufacturer1 Example: TDK; Manufacturer1 ComponentHeight: 1.35mm; HelpURL: \\cern.ch\dfs\Applications\Altium\Datasheets\CC0805_X5R_TDK_C.pdf; Author: CERN DEM JLC; CreateDate: 25.10.2012; LatestRevisionDate: 25.10.2012
C157 = CC0603_1UF_25V_10%_X7R: Non-polarised capacitor; Part Description: SMD Multilayer Chip Ceramic Capacitor; Manufacturer: GENERIC; Manufacturer1 Part Number: GRM188R71E105KA12D; Voltage: 25V; TC: X7R; Tolerance: ±10%; Part Number: CC0603_1UF_25V_10%_X7R; Component Kind: Standard; Component Type: Standard; Pin Count: 2; Value: 1uF; Status: None; Manufacturer Part Number: CC0603_1UF_25V_10%_X7R; Case: 0603; Mounted: Yes; Socket: No; SMD: Yes; Sense: No; Manufacturer1 Example: MURATA; Manufacturer1 ComponentHeight: 0.9mm; HelpURL: \\cern.ch\dfs\Applications\Altium\Datasheets\CC0603_X7R_MURATA.pdf; Author: CERN DEM JLC; CreateDate: 18.01.2011; LatestRevisionDate: 18.01.2011
D10 D11 = PESD3V3L5UY: Fivefold ESD Protection Diode Arrays; Part Description: Fivefold ESD Protection Diode Arrays (30kV); Manufacturer: NEXPERIA; Voltage: 3.3V; Power: 200W; PressFit: No; Bonding: No; Part Number: PESD3V3L5UY; Component Kind: Standard; Component Type: Standard; Device: PESD3V3L5UY; PackageDescription: SOT363, SC-88, 0.65mm Pitch; 6 Pin, 1.25mm W X 2.00mm L X 1.10mm H body, IPC Medium Density; Manufacturer Part Number: PESD3V3L5UY; Pin Count: 6; Case: SOT363; Mounted: Yes; Socket: No; SMD: Yes; Sense: No; ComponentHeight: 1.1mm; HelpURL: \\cern.ch\dfs\Applications\Altium\Datasheets\PESD3V3L5UY.pdf; Author: CERN DEM WB; CreateDate: 05.07.2021; LatestRevisionDate: 05.07.2021
D12 D13 = BAT165: Schottky Diode; Manufacturer: INFINEON; Part Description: Medium Power AF Schottky Diode; Voltage: 40V; Power: 750mA; PressFit: No; Bonding: No; Manufacturer Part Number: BAT165; PackageDescription: Small Outline Diode (SOD-323), 1.70mm W X 1.25mm L X 1.10mm H body,  IPC Medium Density; Part Number: BAT165; Component Kind: Standard; Component Type: Standard; Device: BAT165; Pin Count: 2; Case: SOD323; Mounted: Yes; Socket: No; SMD: Yes; Sense: No; ComponentHeight: 1.1mm; HelpURL: \\cern.ch\dfs\Applications\Altium\Datasheets\BAT165.pdf; Author: CERN DEM JLC; CreateDate: 12.11.2014; LatestRevisionDate: 12.11.2014
IC41 = 74HC4066PW: Part Description: Quad Single-Pole Single-Throw Analog Switch; Manufacturer: NXP SEMICONDUCTORS; PressFit: No; Bonding: No; Table: Standard Logic; Part Number: 74HC4066PW; Component Kind: Standard; Component Type: Standard; Device: 74HC4066PW; PackageDescription: SOP, 14-Leads, Body 4.4x5mm (max), Pitch 0.65mm, IPC Medium Density; Manufacturer Part Number: 74HC4066PW; Pin Count: 14; Case: TSSOP14; Mounted: Yes; Socket: No; SMD: Yes; ComponentHeight: 1.1mm; Author: CERN DEM JLC; HelpURL: \\cern.ch\dfs\Applications\Altium\Datasheets\74HC4066PW.pdf; CreateDate: 2014-11-19; LatestRevisionDate: 2014-11-19
IC42 = TLC555ID: LinCMOS Timer; Manufacturer: TEXAS INSTRUMENTS; PressFit: No; Bonding: No; Part Number: TLC555ID; Component Kind: Standard; Component Type: Standard; Device: TLC555ID; PackageDescription: SOIC 8, Pitch 1.27mm, Body 4x5mm, IPC Medium Density; Part Description: LinCMOS Timer; Manufacturer Part Number: TLC555ID; Pin Count: 8; Case: SOIC8; Mounted: Yes; Socket: No; SMD: Yes; Sense: No; ComponentHeight: 1.75mm; Author: CERN DEM JMW; HelpURL: \\cern.ch\dfs\Applications\Altium\Datasheets\TLC555ID.pdf; CreateDate: 23.08.2016; LatestRevisionDate: 23.08.2016
J19 = AMPHENOL_10052825-101LF: 72 Contacts Header, 6 Columns, 4 Pairs per Column
J20 = AMPHENOL_10052838-101LF: 96 Contacts Header, 8 Columns, 4 Pairs per Column
R316-R320 = R0402_33R_1%_0.0625W_100PPM: Resistor - 1%; Part Description: General Purpose Thick Film Chip Resistor; Manufacturer: GENERIC; Manufacturer1 Part Number: 232270673309L; TC: ±100ppm/°C; PressFit: No; Part Number: R0402_33R_1%_0.0625W_100PPM; Component Kind: Standard; Component Type: Standard; Pin Count: 2; Value: 33; Status: Not Recommended; Power: 0.0625W; Manufacturer Part Number: R0402_33R_1%_0.0625W_100PPM; Case: 0402; Mounted: Yes; Sense: No; Socket: No; SMD: Yes; Manufacturer1 Example: YAGEO PHYCOMP; Manufacturer1 ComponentHeight: 0.4mm; HelpURL: \\cern.ch\dfs\Applications\Altium\Datasheets\R0402_Phycomp_RC0402.pdf; Author: CERN DEM JLC; CreateDate: 03.12.2007; LatestRevisionDate: 17.10.2012
R321 = R0402_200R_1%_0.0625W_100PPM: Resistor - 1%; Part Description: General Purpose Thick Film Chip Resistor; Manufacturer: GENERIC; Manufacturer1 Part Number: 232270672001L; TC: ±100ppm/°C; PressFit: No; Part Number: R0402_200R_1%_0.0625W_100PPM; Component Kind: Standard; Component Type: Standard; Pin Count: 2; Value: 200; Status: Not Recommended; Power: 0.0625W; Tolerance: ±1%; Manufacturer Part Number: R0402_200R_1%_0.0625W_100PPM; Case: 0402; Mounted: Yes; Sense: No; Socket: No; SMD: Yes; Manufacturer1 Example: YAGEO PHYCOMP; Manufacturer1 ComponentHeight: 0.4mm; HelpURL: \\cern.ch\dfs\Applications\Altium\Datasheets\R0402_Phycomp_RC0402.pdf; Author: CERN DEM JLC; CreateDate: 2007-12-03; LatestRevisionDate: 2012-10-17
R322-R326 R328 R332 R333 = R0402_10K_1%_0.0625W_100PPM: Resistor - 1%; Part Description: General Purpose Thick Film Chip Resistor; Manufacturer: GENERIC; Manufacturer1 Part Number: 232270671003L; TC: ±100ppm/°C; Part Number: R0402_10K_1%_0.0625W_100PPM; Component Kind: Standard; Component Type: Standard; Pin Count: 2; Value: 10k; Status: Not recommended; Power: 0.0625W; Tolerance: ±1%; Manufacturer Part Number: R0402_10K_1%_0.0625W_100PPM; Case: 0402; Mounted: Yes; Sense: No; Socket: No; SMD: Yes; Manufacturer1 Example: YAGEO PHYCOMP; Manufacturer1 ComponentHeight: 0.4mm; HelpURL: \\cern.ch\dfs\Applications\Altium\Datasheets\R0402_Phycomp_RC0402.pdf; Author: CERN DEM JLC; CreateDate: 03.12.2007; LatestRevisionDate: 17.10.2012
R327 R331 = R0603_2K7_1%_0.1W_100PPM: Resistor - 1%; Part Description: General Purpose Thick Film Chip Resistor; Manufacturer: GENERIC; Manufacturer1 Part Number: RC0603FR-072K7L; Power: 0.1W; TC: ±100ppm/°C; PressFit: No; Part Number: R0603_2K7_1%_0.1W_100PPM; Component Kind: Standard; Component Type: Standard; Pin Count: 2; Value: 2k7; Status: Preferred; Manufacturer Part Number: R0603_2K7_1%_0.1W_100PPM; Case: 0603; Mounted: Yes; Sense: No; Socket: No; SMD: Yes; Manufacturer1 Example: YAGEO PHYCOMP; Manufacturer1 ComponentHeight: 0.55mm; HelpURL: \\cern.ch\dfs\Applications\Altium\Datasheets\R0603_PHYCOMP_RC0603.pdf; Author: CERN DEM JLC; CreateDate: 02.05.2011; LatestRevisionDate: 02.05.2011
R329 R330 = R0402_0R_JUMPER: as R79 on sheet LVDS_IFC; Part Number: R0402_0R_JUMPER; Component Kind: Standard; Component Type: Standard; Footprint: RESC1005X40N; Pin Count: 2; Value: 0; Status: Not recommended; Manufacturer Part Number: R0402_0R_JUMPER; Case: 0402; Mounted: Yes; Sense: No; Socket: No; SMD: Yes; Manufacturer1 Example: YAGEO PHYCOMP; Manufacturer1 ComponentHeight: 0.4mm; HelpURL: \\cern.ch\dfs\Applications\Altium\Datasheets\R0402_Phycomp_RC0402.pdf; Author: CERN DEM JLC; CreateDate: 03.12.2007; LatestRevisionDate: 17.10.2012
T17-T20 = BSS138LT1G: N-CHANNEL MOSFET WITH DIODE; Part Description: 50V, 200mA N-Channel Enhancement Mode Field-Effect Transistor; Manufacturer: ON SEMICONDUCTOR; PressFit: No; Bonding: No; Part Number: BSS138LT1G; Component Kind: Standard; Component Type: Standard; Device: BSS138LT1G; PackageDescription: SOT23, 0.95mm Pitch; 3 Pin, 1.40mm W X 3.00mm L X 1.10mm H body, IPC Medium Density; Manufacturer Part Number: BSS138L; Pin Count: 3; Case: SOT23-3; Mounted: Yes; Socket: No; SMD: Yes; Sense: No; ComponentHeight: 1.11mm; HelpURL: \\cern.ch\dfs\Applications\Altium\Datasheets\BSS138LT1G.pdf; Author: CERN DEM JLC; CreateDate: 23.03.2009; LatestRevisionDate: 25.05.2022